# EAGLE design AVRAndDriver (EAGLE 5.04)
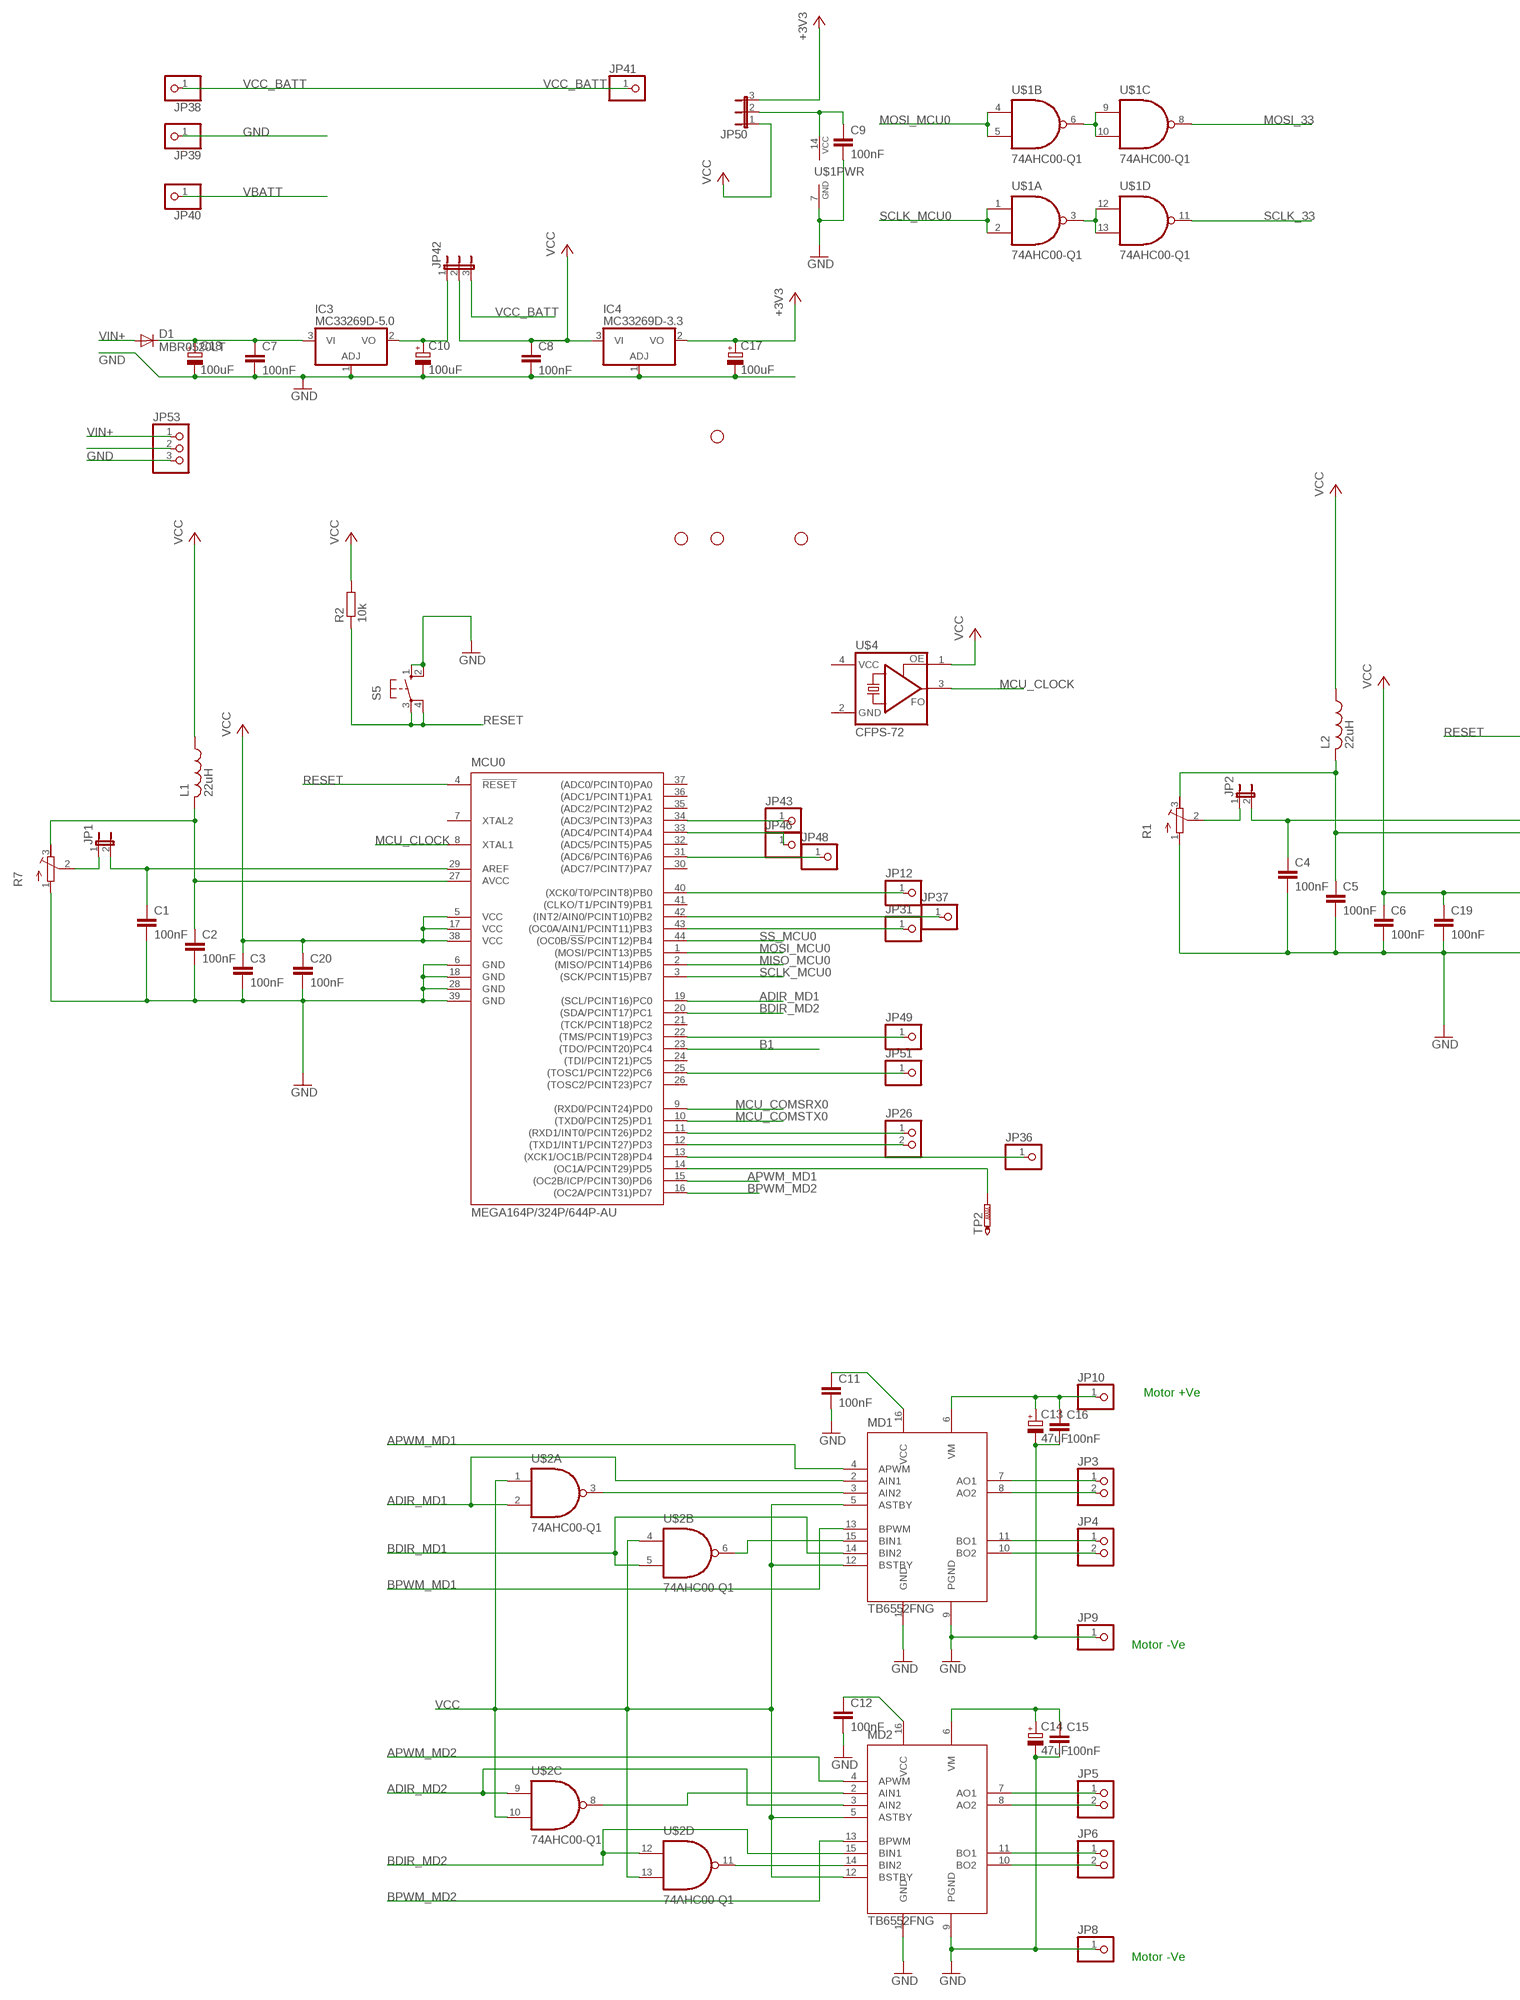
[diagram p0: schematic, sheet 1, part 1 of 2]
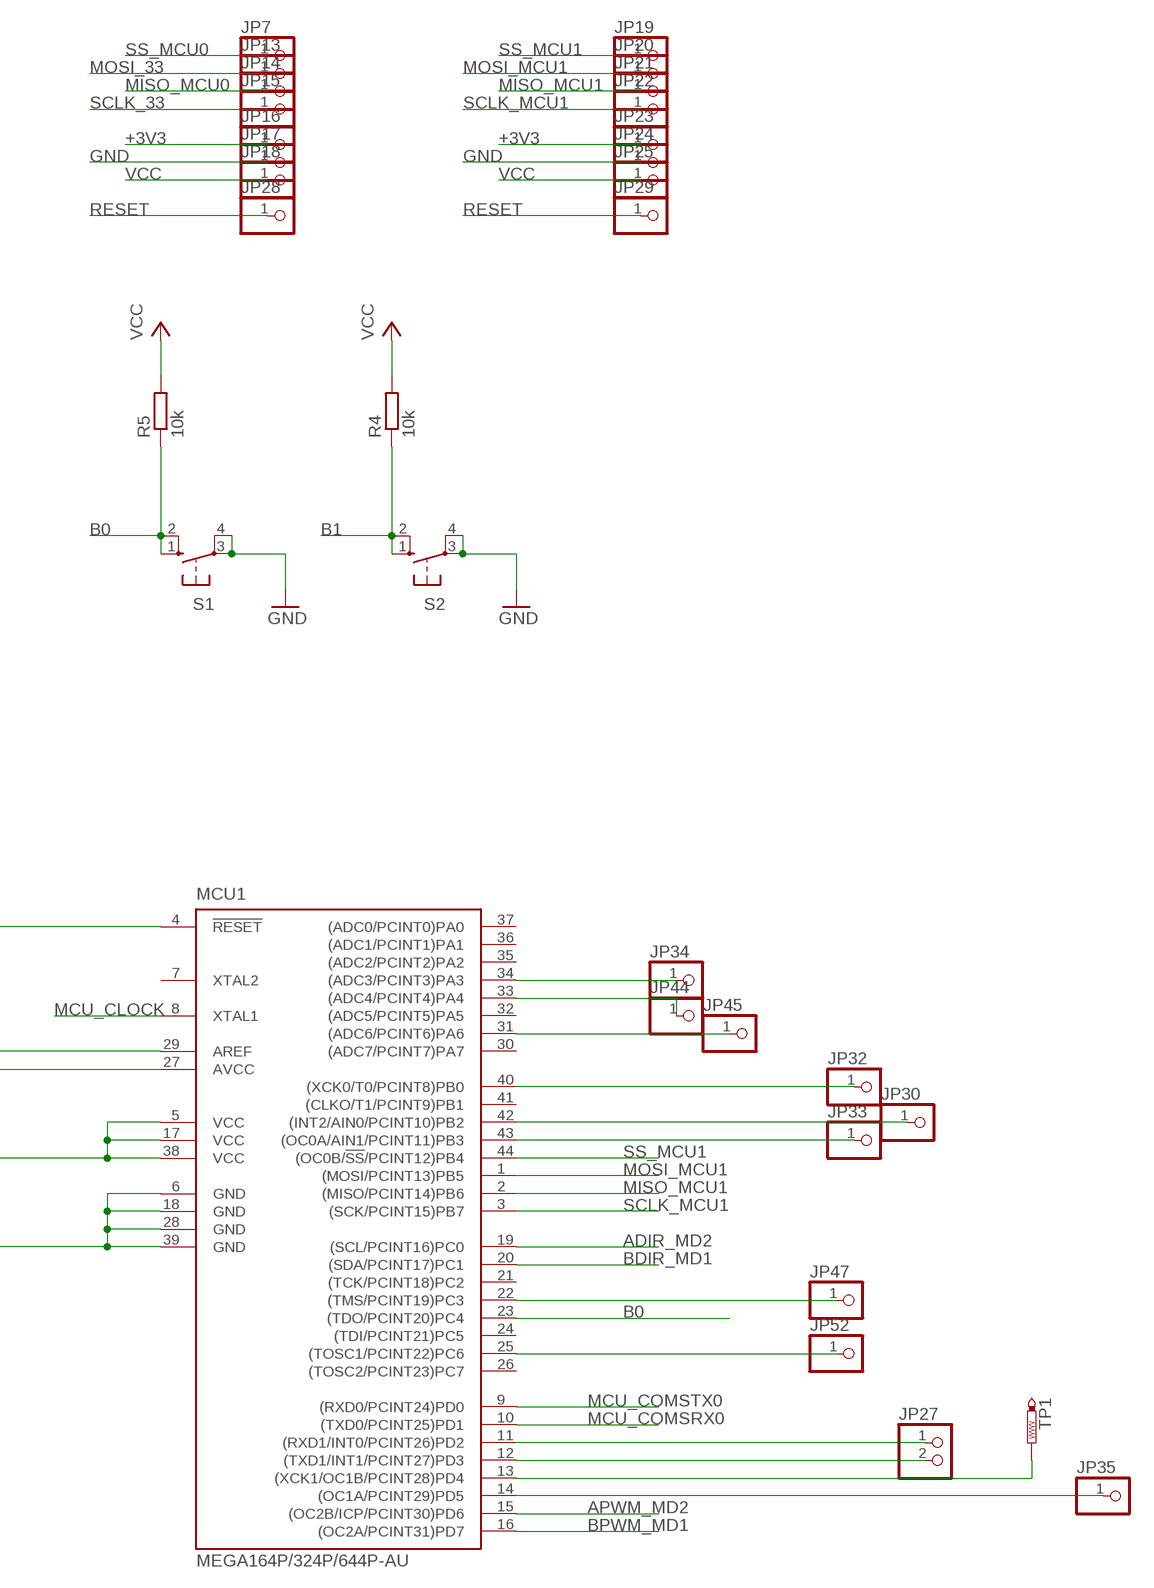
[diagram p1: schematic, sheet 1, part 2 of 2]

## Parts
C1  100nF  C-EUC1206K  [C1206K]
C2  100nF  C-EUC1206K  [C1206K]
C3  100nF  C-EUC1206K  [C1206K]
C4  100nF  C-EUC1206K  [C1206K]
C5  100nF  C-EUC1206K  [C1206K]
C6  100nF  C-EUC1206K  [C1206K]
C7  100nF  C-EUC1206K  [C1206K]
C8  100nF  C-EUC1206K  [C1206K]
C9  100nF  C-EUC1206K  [C1206K]
C10  100uF  CPOL-EUE2-5  [E2-5]
C11  100nF  C-EUC1206K  [C1206K]
C12  100nF  C-EUC1206K  [C1206K]
C13  47uF  CPOL-EUE2-5  [E2-5]
C14  47uF  CPOL-EUE2-5  [E2-5]
C15  100nF  C-EUC1206K  [C1206K]
C16  100nF  C-EUC1206K  [C1206K]
C17  100uF  CPOL-EUE2-5  [E2-5]
C18  100uF  CPOL-EUE2-5  [E2-5]
C19  100nF  C-EUC1206K  [C1206K]
C20  100nF  C-EUC1206K  [C1206K]
D1  MBR0520LT  [SOD123]
IC3  MC33269D-5.0  [DPACK]
IC4  MC33269D-3.3  [DPACK]
JP1  JP1E  [JP1]
JP2  JP1E  [JP1]
JP3  PINHD-1X2  [1X02]
JP4  PINHD-1X2  [1X02]
JP5  PINHD-1X2  [1X02]
JP6  PINHD-1X2  [1X02]
JP7  PINHD-1X1  [1X01]
JP8  PINHD-1X1  [1X01]
JP9  PINHD-1X1  [1X01]
JP10  PINHD-1X1  [1X01]
JP12  PINHD-1X1  [1X01]
JP13  PINHD-1X1  [1X01]
JP14  PINHD-1X1  [1X01]
JP15  PINHD-1X1  [1X01]
JP16  PINHD-1X1  [1X01]
JP17  PINHD-1X1  [1X01]
JP18  PINHD-1X1  [1X01]
JP19  PINHD-1X1  [1X01]
JP20  PINHD-1X1  [1X01]
JP21  PINHD-1X1  [1X01]
JP22  PINHD-1X1  [1X01]
JP23  PINHD-1X1  [1X01]
JP24  PINHD-1X1  [1X01]
JP25  PINHD-1X1  [1X01]
JP26  PINHD-1X2  [1X02]
JP27  PINHD-1X2  [1X02]
JP28  PINHD-1X1  [1X01]
JP29  PINHD-1X1  [1X01]
JP30  PINHD-1X1  [1X01]
JP31  PINHD-1X1  [1X01]
JP32  PINHD-1X1  [1X01]
JP33  PINHD-1X1  [1X01]
JP34  PINHD-1X1  [1X01]
JP35  PINHD-1X1  [1X01]
JP36  PINHD-1X1  [1X01]
JP37  PINHD-1X1  [1X01]
JP38  PINHD-1X1  [1X01]
JP39  PINHD-1X1  [1X01]
JP40  PINHD-1X1  [1X01]
JP41  PINHD-1X1  [1X01]
JP42  JP2E  [JP2]
JP43  PINHD-1X1  [1X01]
JP44  PINHD-1X1  [1X01]
JP45  PINHD-1X1  [1X01]
JP46  PINHD-1X1  [1X01]
JP47  PINHD-1X1  [1X01]
JP48  PINHD-1X1  [1X01]
JP49  PINHD-1X1  [1X01]
JP50  JP2E  [JP2]
JP51  PINHD-1X1  [1X01]
JP52  PINHD-1X1  [1X01]
JP53  PINHD-1X3  [1X03]
L1  22uH  L-US  [ELL6SH]
L2  22uH  L-US  [ELL6SH]
MCU0  MEGA164P/324P/644P-AU  [TQFP44]
MCU1  MEGA164P/324P/644P-AU  [TQFP44]
MD1  TB6552FNG  [SSOP16-P-225-0.65B]
MD2  TB6552FNG  [SSOP16-P-225-0.65B]
R1  R-TRIMM3296W  [RTRIM3296W]
R2  10k  R-EU_R0805  [R0805]
R4  10k  R-EU_R0805  [R0805]
R5  10k  R-EU_R0805  [R0805]
R7  R-TRIMM3296W  [RTRIM3296W]
S1  10-XX  [B3F-10XX]
S2  10-XX  [B3F-10XX]
S5  10-XX  [B3F-10XX]
TP1  PTR1TP10R  [TP10R]
TP2  PTR1TP10R  [TP10R]
U$1  74AHC00-Q1  [TSSOP14-PW]
U$2  74AHC00-Q1  [TSSOP14-PW]
U$3  STAND-OFF  [STAND-OFF]
U$4  CFPS-72  [CFPS]
U$5  STAND-OFF  [STAND-OFF]
U$6  STAND-OFF  [STAND-OFF]
U$7  STAND-OFF  [STAND-OFF]

## Nets
+3V3: C17.+ IC4.2(VO) JP16.1 JP23.1 JP50.3
ADIR_MD1: MCU0.19((SCL/PCINT16)PC0) MD1.2(AIN1) U$2.2(A:B)
ADIR_MD2: MCU1.19((SCL/PCINT16)PC0) MD2.3(AIN2) U$2.9(C:A)
APWM_MD1: MCU0.15((OC2B/ICP/PCINT30)PD6) MD1.4(APWM)
APWM_MD2: MCU1.15((OC2B/ICP/PCINT30)PD6) MD2.4(APWM)
AVCC0: C2.1 L1.2 MCU0.27(AVCC) R7.3(A)
AVCC1: C5.1 L2.2 MCU1.27(AVCC) R1.3(A)
B0: MCU1.23((TDO/PCINT20)PC4) R5.1 S1.1(S) S1.2(S1)
B1: MCU0.23((TDO/PCINT20)PC4) R4.1 S2.1(S) S2.2(S1)
BDIR_MD1: MCU1.20((SDA/PCINT17)PC1) MD1.14(BIN2) U$2.5(B:B)
BDIR_MD2: MCU0.20((SDA/PCINT17)PC1) MD2.15(BIN1) U$2.12(D:A)
BPWM_MD1: MCU1.16((OC2A/PCINT31)PD7) MD1.13(BPWM)
BPWM_MD2: MCU0.16((OC2A/PCINT31)PD7) MD2.13(BPWM)
GND: C1.2 C2.2 C3.2 C4.2 C5.2 C6.2 C7.2 C8.2 C9.2 C10.- C11.2 C12.2 C17.- C18.- C19.2 C20.2 IC3.1(ADJ) IC4.1(ADJ) JP17.1 JP24.1 JP39.1 JP53.2 MCU0.6(GND) MCU0.18(GND) MCU0.28(GND) MCU0.39(GND) MCU1.6(GND) MCU1.18(GND) MCU1.28(GND) MCU1.39(GND) MD1.1(GND) MD2.1(GND) R1.1(E) R7.1(E) S1.3(P) S1.4(P1) S2.3(P) S2.4(P1) S5.1(S) S5.2(S1) U$1.7(PWR:GND)
MCU_CLOCK: MCU0.8(XTAL1) MCU1.8(XTAL1) U$4.3(FO)
MCU_COMSRX0: MCU0.9((RXD0/PCINT24)PD0) MCU1.10((TXD0/PCINT25)PD1)
MCU_COMSTX0: MCU0.10((TXD0/PCINT25)PD1) MCU1.9((RXD0/PCINT24)PD0)
MISO_MCU0: JP14.1 MCU0.2((MISO/PCINT14)PB6)
MISO_MCU1: JP21.1 MCU1.2((MISO/PCINT14)PB6)
MOSI_33: JP13.1 U$1.8(C:OUT)
MOSI_MCU0: MCU0.1((MOSI/PCINT13)PB5) U$1.4(B:A) U$1.5(B:B)
MOSI_MCU1: JP20.1 MCU1.1((MOSI/PCINT13)PB5)
N$1: JP30.1 MCU1.42((INT2/AIN0/PCINT10)PB2)
N$2: JP32.1 MCU1.40((XCK0/T0/PCINT8)PB0)
N$3: JP48.1 MCU0.31((ADC6/PCINT6)PA6)
N$4: C10.+ IC3.2(VO) JP42.1
N$5: JP27.1 MCU1.11((RXD1/INT0/PCINT26)PD2)
N$6: JP36.1 MCU0.13((XCK1/OC1B/PCINT28)PD4)
N$7: JP1.1 R7.2(S)
N$8: C1.1 JP1.2 MCU0.29(AREF)
N$9: JP27.2 MCU1.12((TXD1/INT1/PCINT27)PD3)
N$10: MCU0.14((OC1A/PCINT29)PD5) TP2.TP
N$11: JP31.1 MCU0.43((OC0A/AIN1/PCINT11)PB3)
N$12: C4.1 JP2.2 MCU1.29(AREF)
N$13: MCU1.13((XCK1/OC1B/PCINT28)PD4) TP1.TP
N$14: JP2.1 R1.2(S)
N$15: U$1.3(A:OUT) U$1.12(D:A) U$1.13(D:B)
N$16: U$1.6(B:OUT) U$1.9(C:A) U$1.10(C:B)
N$17: C7.1 C18.+ D1.C IC3.3(VI)
N$18: JP26.2 MCU0.12((TXD1/INT1/PCINT27)PD3)
N$19: JP26.1 MCU0.11((RXD1/INT0/PCINT26)PD2)
N$20: JP35.1 MCU1.14((OC1A/PCINT29)PD5)
N$21: MD2.14(BIN2) U$2.11(D:OUT)
N$22: JP33.1 MCU1.43((OC0A/AIN1/PCINT11)PB3)
N$23: MD1.3(AIN2) U$2.3(A:OUT)
N$24: MD2.2(AIN1) U$2.8(C:OUT)
N$25: JP46.1 MCU0.33((ADC4/PCINT4)PA4)
N$26: MD1.15(BIN1) U$2.6(B:OUT)
N$27: JP43.1 MCU0.34((ADC3/PCINT3)PA3)
N$28: JP37.1 MCU0.42((INT2/AIN0/PCINT10)PB2)
N$29: JP12.1 MCU0.40((XCK0/T0/PCINT8)PB0)
N$30: JP34.1 MCU1.34((ADC3/PCINT3)PA3)
N$31: JP3.1 MD1.7(AO1)
N$32: JP3.2 MD1.8(AO2)
N$33: JP4.1 MD1.11(BO1)
N$34: JP4.2 MD1.10(BO2)
N$35: JP5.1 MD2.7(AO1)
N$36: JP5.2 MD2.8(AO2)
N$37: JP6.1 MD2.11(BO1)
N$38: JP6.2 MD2.10(BO2)
N$39: JP45.1 MCU1.31((ADC6/PCINT6)PA6)
N$40: JP44.1 MCU1.33((ADC4/PCINT4)PA4)
N$41: JP47.1 MCU1.22((TMS/PCINT19)PC3)
N$42: JP49.1 MCU0.22((TMS/PCINT19)PC3)
N$43: C9.1 JP50.2 U$1.14(PWR:VCC)
N$44: JP51.1 MCU0.25((TOSC1/PCINT22)PC6)
N$45: JP52.1 MCU1.25((TOSC1/PCINT22)PC6)
PGND: C13.- C14.- C15.2 C16.2 JP8.1 JP9.1 MD1.9(PGND) MD2.9(PGND) ; supply symbol labelled GND
RESET: JP28.1 JP29.1 MCU0.4(!RESET) MCU1.4(!RESET) R2.1 S5.3(P) S5.4(P1)
SCLK_33: JP15.1 U$1.11(D:OUT)
SCLK_MCU0: MCU0.3((SCK/PCINT15)PB7) U$1.1(A:A) U$1.2(A:B)
SCLK_MCU1: JP22.1 MCU1.3((SCK/PCINT15)PB7)
SS_MCU0: JP7.1 MCU0.44((OC0B/!SS!/PCINT12)PB4)
SS_MCU1: JP19.1 MCU1.44((OC0B/!SS!/PCINT12)PB4)
VBATT: JP40.1 JP53.3
VCC: C3.1 C6.1 C8.1 C11.1 C12.1 C19.1 C20.1 IC4.3(VI) JP18.1 JP25.1 JP42.2 JP50.1 L1.1 L2.1 MCU0.5(VCC) MCU0.17(VCC) MCU0.38(VCC) MCU1.5(VCC) MCU1.17(VCC) MCU1.38(VCC) MD1.5(ASTBY) MD1.12(BSTBY) MD1.16(VCC) MD2.5(ASTBY) MD2.12(BSTBY) MD2.16(VCC) R2.2 R4.2 R5.2 U$2.1(A:A) U$2.4(B:A) U$2.10(C:B) U$2.13(D:B) U$4.1(OE)
VCC_BATT: JP38.1 JP41.1 JP42.3
VIN+: D1.A JP53.1
VM: C13.+ C14.+ C15.1 C16.1 JP10.1 MD1.6(VM) MD2.6(VM)
Unconnected: MCU0.7(XTAL2) MCU0.21((TCK/PCINT18)PC2) MCU0.24((TDI/PCINT21)PC5) MCU0.26((TOSC2/PCINT23)PC7) MCU0.30((ADC7/PCINT7)PA7) MCU0.32((ADC5/PCINT5)PA5) MCU0.35((ADC2/PCINT2)PA2) MCU0.36((ADC1/PCINT1)PA1) MCU0.37((ADC0/PCINT0)PA0) MCU0.41((CLKO/T1/PCINT9)PB1) MCU1.7(XTAL2) MCU1.21((TCK/PCINT18)PC2) MCU1.24((TDI/PCINT21)PC5) MCU1.26((TOSC2/PCINT23)PC7) MCU1.30((ADC7/PCINT7)PA7) MCU1.32((ADC5/PCINT5)PA5) MCU1.35((ADC2/PCINT2)PA2) MCU1.36((ADC1/PCINT1)PA1) MCU1.37((ADC0/PCINT0)PA0) MCU1.41((CLKO/T1/PCINT9)PB1)

## Notes on the sheet
- Motor +Ve
- Motor -Ve
- Motor -Ve

## Power pins joined to a net without a drawn wire
GND: U$2.7(PWR:GND) U$4.2(GND)
VCC: U$2.14(PWR:VCC) U$4.4(VCC)

## Library data of the parts
C1-C9 C11 C12 C15 C16 C19 C20 = rcl:C-EU: CAPACITOR, European symbol
C10 C13 C14 C17 C18 = rcl:CPOL-EU: POLARIZED CAPACITOR, European symbol
D1 = diode:MBR0520LT: SCHOTTKY BARRIER RECTIFIER Source: http://onsemi.com .. MBR0520LT1-D.pdf
IC3 IC4 = linear:MC33269?*: Adjustable Output Low Dropout Voltage Regulator 800 mA Source: http://www.onsemi.com/pub/Collateral/MC33269-D.PDF
JP1 JP2 = jumper:JP1E: JUMPER
JP3-JP6 JP26 JP27 = pinhead:PINHD-1X2: PIN HEADER
JP7-JP10 JP12-JP25 JP28-JP41 JP43-JP49 JP51 JP52 = pinhead:PINHD-1X1: PIN HEADER
JP42 JP50 = jumper:JP2E: JUMPER
JP53 = pinhead:PINHD-1X3: PIN HEADER
L1 L2 = rcl:L-US: INDUCTOR, American symbol
MCU0 MCU1 = avr-5:MEGA164P/324P/644P-AU
MD1 MD2 = toshiba-MotorDrivers:TB6552FNG
R1 R7 = rcl:R-TRIMM: Trimm resistor
R2 R4 R5 = rcl:R-EU_: RESISTOR, European symbol
S1 S2 S5 = switch-omron:10-XX: OMRON SWITCH
TP1 TP2 = testpad:PTR1: TEST PIN
U$1 U$2 = 74ah:74AHC00-Q1
U$3 U$5-U$7 = SparkFun:STAND-OFF: Stand Off This is the mechanical footprint for a #4 phillips button head screw. Use the keepout ring to avoid running the screw head into surrounding components. SKU : PRT-00447
U$4 = crystal:CFPS-72

## Board
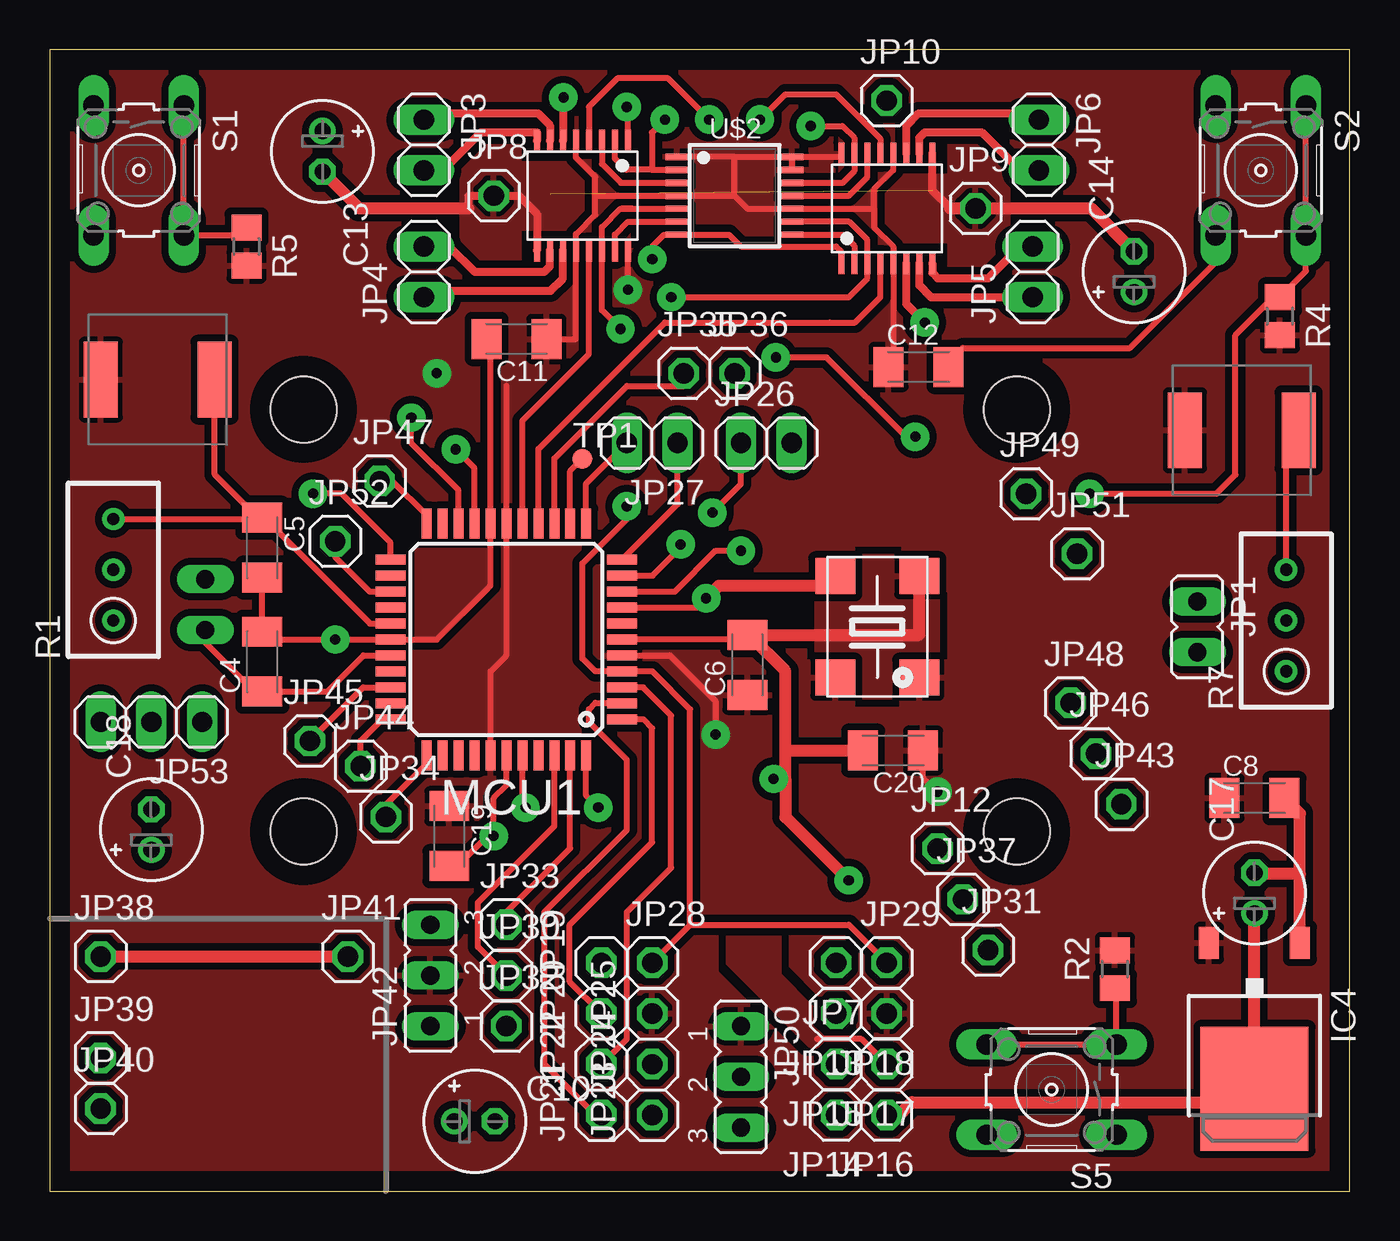
[diagram p2: board, top side]
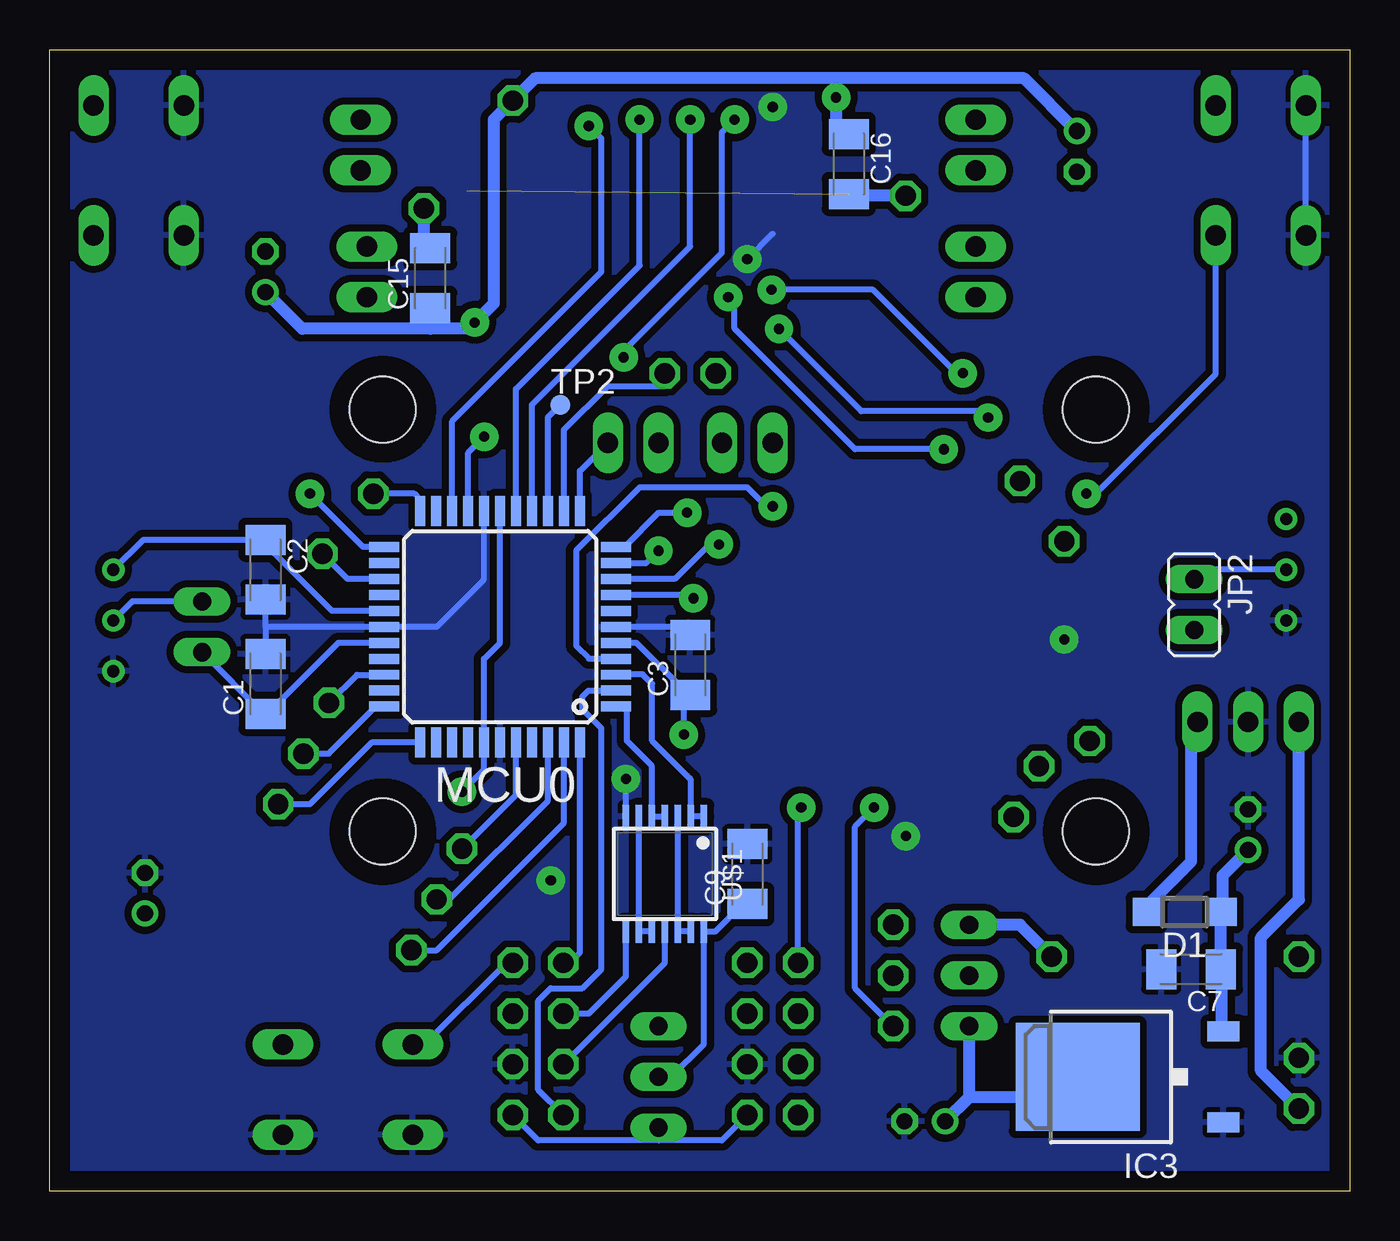
[diagram p3: board, bottom side, seen from below]

Size 65.09 x 57.15 mm. Coordinates in mm from the lower left corner, seen from the top.
Outline: 0,0 65.09,0 65.09,57.15 0,57.15 0,0
Copper layers (1*16): Top 0.035mm / dielectric 1.5mm / Bottom 0.035mm
Design rules "default *": minimum track width 12mil, minimum drill 24mil, track to track 12mil, track to pad 12mil, pad to pad 12mil, via to via 12mil, smd to smd 12mil, copper to edge 40mil, drill to drill 6mil, minimum pad ring 10mil, minimum via ring 8mil, stop-mask expansion 4mil, vias tented up to drill 0mil, thermal gap 10mil

### Footprints (pad centres in the part's own frame; a part is rotated, then mirrored left to right if it is on the bottom)
C1206K = smd 1.5 x 2: 1 -1.5,0; 2 1.5,0
E2-5 = drill 0.813 pad 1.27 round: + -1.016,0 | drill 0.813 pad 1.27 octagon: - 1.016,0
SOD123 = smd 1.4 x 1.4: A 1.9,0; C -1.9,0
DPACK = smd 1 x 1.6: 1 -2.28,-4.8; 3 2.28,-4.8 | smd 5.4 x 6.2: 2 0,2.5
JP1 = drill 0.914 long: 1 0,-1.27; 2 0,1.27
1X02 = drill 1.016 long: 1 -1.27,0; 2 1.27,0
1X01 = drill 1.016 octagon: 1 0,0
JP2 = drill 0.914 long: 1 -2.54,0; 2 0,0; 3 2.54,0
1X03 = drill 1.016 long: 1 -2.54,0; 2 0,0; 3 2.54,0
ELL6SH = smd 1.7 x 3.8: 1 -2.85,0; 2 2.85,0
TQFP44 = smd 1.5 x 0.5: 1 -5.8,4; 2 -5.8,3.2; 3 -5.8,2.4; 4 -5.8,1.6; 5 -5.8,0.8; 6 -5.8,0; 7 -5.8,-0.8; 8 -5.8,-1.6; 9 -5.8,-2.4; 10 -5.8,-3.2; 11 -5.8,-4; 23 5.8,-4; 24 5.8,-3.2; 25 5.8,-2.4; 26 5.8,-1.6; 27 5.8,-0.8; 28 5.8,0; 29 5.8,0.8; 30 5.8,1.6; 31 5.8,2.4; 32 5.8,3.2; 33 5.8,4 | smd 0.5 x 1.5: 12 -4,-5.8; 13 -3.2,-5.8; 14 -2.4,-5.8; 15 -1.6,-5.8; 16 -0.8,-5.8; 17 0,-5.8; 18 0.8,-5.8; 19 1.6,-5.8; 20 2.4,-5.8; 21 3.2,-5.8; 22 4,-5.8; 34 4,5.8; 35 3.2,5.8; 36 2.4,5.8; 37 1.6,5.8; 38 0.8,5.8; 39 0,5.8; 40 -0.8,5.8; 41 -1.6,5.8; 42 -2.4,5.8; 43 -3.2,5.8; 44 -4,5.8
SSOP16-P-225-0.65B = smd 1.1 x 0.3: 1 -2.75,2.275; 2 -2.75,1.625; 3 -2.75,0.975; 4 -2.75,0.325; 5 -2.75,-0.325; 6 -2.75,-0.975; 7 -2.75,-1.625; 8 -2.75,-2.275; 9 2.75,-2.275; 10 2.75,-1.625; 11 2.75,-0.975; 12 2.75,-0.325; 13 2.75,0.325; 14 2.75,0.975; 15 2.75,1.625; 16 2.75,2.275
RTRIM3296W = drill 0.61 round: 1 0,-2.54; 2 0,0; 3 0,2.54
R0805 = smd 1.3 x 1.5: 1 -0.95,0; 2 0.95,0
B3F-10XX = drill 1.016 long: 1 -3.251,2.261; 2 3.251,2.261; 3 -3.251,-2.261; 4 3.251,-2.261
TP10R = smd 1 x 1: TP 0,0
TSSOP14-PW = smd 0.32 x 1.15: 1 -1.95,-2.875; 2 -1.3,-2.875; 3 -0.65,-2.875; 4 0,-2.875; 5 0.65,-2.875; 6 1.3,-2.875; 7 1.95,-2.875; 8 1.95,2.875; 9 1.3,2.875; 10 0.65,2.875; 11 0,2.875; 12 -0.65,2.875; 13 -1.3,2.875; 14 -1.95,2.875
STAND-OFF = hole 3.302: 0,0
CFPS = smd 1.8 x 2: 1 -2.54,-2.1; 2 2.54,-2.1; 3 2.54,2.1; 4 -2.54,2.1

### Placement (x,y rotation side)
C1  54.29,25.4 90 bottom
C2  54.29,31.11 270 bottom
C3  33.02,26.35 90 bottom
C4  10.64,26.51 90 top
C5  10.64,32.23 270 top
C6  34.92,26.35 90 top
C7  7.94,11.11 180 bottom
C8  60.33,19.68 0 top
C9  30.16,15.88 90 bottom
C10  21.27,3.49 0 top
C11  23.37,42.67 180 top
C12  43.5,41.27 0 top
C13  13.65,52.07 270 top
C14  54.29,46.04 90 top
C15  46.04,45.72 90 bottom
C16  25.08,51.44 270 bottom
C17  60.33,14.92 90 top
C18  5.08,18.1 90 top
C19  20,17.78 270 top
C20  42.23,22.07 180 top
D1  8.26,13.97 180 bottom
IC3  11.11,5.71 90 bottom
IC4  60.33,7.62 180 top
JP1  57.47,28.26 180 top
JP2  7.78,29.37 180 bottom
JP3  18.73,52.39 270 top
JP4  18.73,46.04 90 top
JP5  49.21,46.04 90 top
JP6  49.53,52.39 270 top
JP7  39.37,11.43 180 top
JP8  22.23,49.85 0 top
JP9  46.35,49.21 0 top
JP10  41.91,54.61 0 top
JP12  44.45,17.14 0 top
JP13  39.37,8.89 180 top
JP14  39.37,3.81 180 top
JP15  39.37,6.35 180 top
JP16  41.91,3.81 180 top
JP17  41.91,6.35 180 top
JP18  41.91,8.89 180 top
JP19  27.62,11.43 90 top
JP20  27.62,8.89 90 top
JP21  27.62,3.81 90 top
JP22  27.62,6.35 90 top
JP23  30.16,3.81 90 top
JP24  30.16,6.35 90 top
JP25  30.16,8.89 90 top
JP26  35.88,37.47 0 top
JP27  30.16,37.47 180 top
JP28  30.16,11.43 0 top
JP29  41.91,11.43 0 top
JP30  22.86,10.79 0 top
JP31  46.99,12.06 0 top
JP32  22.86,8.26 0 top
JP33  22.86,13.34 0 top
JP34  16.83,18.73 0 top
JP35  31.75,40.96 0 top
JP36  34.29,40.96 0 top
JP37  45.72,14.61 0 top
JP38  2.54,11.75 0 top
JP39  2.54,6.67 0 top
JP40  2.54,4.13 0 top
JP41  14.92,11.75 0 top
JP42  19.05,10.79 90 top
JP43  53.66,19.37 0 top
JP44  15.56,21.27 0 top
JP45  13.02,22.54 0 top
JP46  52.39,21.91 0 top
JP47  16.51,35.56 0 top
JP48  51.12,24.45 0 top
JP49  48.9,34.92 0 top
JP50  34.61,5.71 270 top
JP51  51.44,31.91 0 top
JP52  14.29,32.54 0 top
JP53  5.08,23.5 180 top
L1  59.69,38.1 0 top
L2  5.4,40.64 0 top
MCU0  42.55,28.26 180 bottom
MCU1  22.86,27.62 180 top
MD1  26.67,49.85 270 top
MD2  41.91,49.21 90 top
R1  3.17,31.11 0 top
R2  53.34,11.11 90 top
R4  61.59,43.81 270 top
R5  9.84,47.31 270 top
R7  61.91,28.57 0 top
S1  4.45,51.12 270 top
S2  60.64,51.12 270 top
S5  50.16,5.08 180 top
TP1  26.67,36.67 0 top
TP2  39.53,39.37 0 bottom
U$1  34.29,15.88 180 bottom
U$2  34.29,49.85 270 top
U$3  48.42,39.14 0 top
U$4  41.43,28.26 90 top
U$5  48.42,18.01 0 top
U$6  12.7,18.01 0 top
U$7  12.7,39.14 0 top

### Tracks (layer width: path | path; a pad name or v marks a point on that pad's centre or on a via)
+3V3
  Top 0.61: C17.+ IC4.2 60.33,4.45 43.18,4.45 42.39,3.65 41.91,3.65 JP16.1
  Bottom 0.305: JP16.1 40.64,2.54 34.61,2.54 | JP23.1 31.43,2.54 34.61,2.54 | 34.61,2.54 JP50.3
ADIR_MD1  (via drill 0.51 pad 1.42)
  Top 0.305: MD1.2 28.3,51.72 28.86,51.15 30.15,51.15 | 30.15,51.15 U$2.2 | 30.15,51.15 30.15,53.01 v30.8,53.66 | v43.34,37.78 42.86,37.78 38.89,41.75 v36.35,41.75
  Bottom 0.305: v30.8,53.66 31.43,53.02 31.43,46.99 36.35,42.07 v36.35,41.75 | MCU0.19 44.15,36.98 v43.34,37.78
ADIR_MD2  (via drill 0.51 pad 1.42)
  Top 0.305: U$2.9 40.03,48.55 40.94,47.65 MD2.3 40.94,45.7 40.01,44.77 v31.11,44.77 | MCU1.19 21.26,36.21 v20.32,37.15
  Bottom 0.305: v31.11,44.77 30.8,44.45 30.8,43.18 24.77,37.15 v20.32,37.15
APWM_MD1  (via drill 0.51 pad 1.42)
  Top 0.305: MD1.4 27,54.3 28.42,55.72 30.96,55.72 v33.02,53.66
  Bottom 0.305: v33.02,53.66 33.02,47.31 40.95,39.38 MCU0.15
APWM_MD2
  Top 0.305: MCU1.15 24.46,37.16 30.8,43.5 39.05,43.5 40.32,43.5 41.59,44.76 MD2.4
AVCC0
  Top 0.305: L1.2 61.91,37.47 R7.3
  Bottom 0.305: C2.1 54.52,32.62 | R7.3 60.41,32.62 C2.1 | MCU0.27 50.97,29.06 54.29,32.38 C2.1
AVCC1
  Top 0.305: L2.2 8.26,39.36 8.26,35.88 10.41,33.73 C5.1 | MCU1.27 16.03,28.42 10.72,33.73 C5.1 | C5.1 10.64,33.66 R1.3
B0  (via drill 0.51 pad 1.42)
  Top 0.305: S1.1 S1.2 9.84,47.87 R5.1 | MCU1.23 17.06,32.47 14.61,34.92 v13.18,34.92
  Bottom 0.305: S1.2 6.71,40.92 12.7,34.92 v13.18,34.92
B1  (via drill 0.51 pad 1.42)
  Top 0.305: S2.1 S2.2 62.9,46.07 R4.1 61.28,44.77 59.37,42.86 59.37,35.88 58.42,34.92 v52.07,34.92
  Bottom 0.305: MCU0.23 49.4,32.26 v52.07,34.92
BDIR_MD1  (via drill 0.51 pad 1.42)
  Top 0.305: 29.21,49.2 28.59,49.2 | 29.21,49.2 U$2.5 | 29.21,49.2 28.56,49.2 27.64,48.28 MD1.14 27.64,44.11 v28.57,43.18 | MCU1.20 20.46,35.1 18.1,37.47 v18.1,38.73
  Bottom 0.305: v28.57,43.18 24.45,39.05 18.41,39.05 v18.1,38.73
BDIR_MD2  (via drill 0.51 pad 1.42)
  Top 0.305: U$2.12 37.18,50.48 39.69,50.48 40.28,51.08 MD2.15 40.28,52.74 39.69,53.34 v38.1,53.34
  Bottom 0.305: v38.1,53.34 37.47,52.7 37.47,46.04 44.95,38.56 MCU0.20
BPWM_MD1
  Top 0.305: MD1.13 27,41.92 23.66,38.58 MCU1.16
BPWM_MD2  (via drill 0.51 pad 1.42)
  Top 0.305: MD2.13 41.59,52.71 39.37,54.93 36.83,54.93 v35.56,53.66
  Bottom 0.305: v35.56,53.66 35.56,46.35 41.74,40.17 MCU0.16
GND  (via drill 0.51 pad 1.42)
  Top 0.305: MD2.1 39.63,47.04 39.37,47.31 34.61,47.31 34.02,47.9 U$2.7 30.75,47.9 30.16,47.31 v30.16,46.67 | C12.2 45,41.51 45.72,42.23 54.09,42.23 58.38,46.52 S2.4 | MCU1.6 34.92,27.62 C6.2 | MCU1.39 22.86,20.32 22.23,19.68 v22.23,17.78 21.91,17.78 20.41,16.28 C19.2 | C5.2 | C5.2 C4.2 10.64,27.62 v14.29,27.62 MCU1.28 19.37,27.62 22.06,30.32 MCU1.18 22.06,42.67 C11.2 | MD1.1 28.95,54.24 v28.89,54.29 | JP17.1 40.64,7.62 38.42,7.62
  Top 0.61: IC4.1 62.6,15.88 | 62.6,15.88 62.6,18.91 C8.2 | 35.01,27.85 C6.2 34.92,28.29 | 35.01,27.85 36.83,26.04 36.83,22.07 | v36.24,20.64 36.83,20.64 | 35.01,27.85 43.53,27.85 U$4.2 | 36.83,22.07 C20.2 | 36.83,20.64 36.83,22.07 | C17.- 60.33,15.88 62.6,15.88 | 36.83,20.64 36.83,18.73 v40.01,15.56
  Bottom 0.305: S1.4 S1.3 | MCU0.6 33.02,28.26 C3.2 | v30.16,46.67 28.89,47.94 | U$1.7 v36.24,20.64 | MCU0.18 43.34,30.63 45.72,28.26 MCU0.28 54.29,28.26 | 54.29,28.26 C1.2 | 54.29,28.26 C2.2
  pour Bottom (isolate 0.356, rank 2): 0,0 0,57.15 65.09,57.15 65.09,0
  pour Top (isolate 0.356, rank 2): 40.48,31.75 38.42,29.69 38.42,26.83 40.48,24.77 42.39,24.77 44.45,26.99 44.45,29.53 42.39,31.75
  pour Top (isolate 0.356, rank 3): 18.41,32.07 21.91,32.07 21.91,30.16 19.37,27.62 18.41,27.62
  pour Top (isolate 0.356, rank 2): 33.97,12.7 33.97,11.43 38.1,7.3 38.42,7.3 38.73,7.62 38.42,7.94 38.1,8.26 38.1,9.21 36.51,10.79 36.51,12.7
MCU_CLOCK  (via drill 0.51 pad 1.42)
  Top 0.305: MCU1.8 32.4,29.22 v32.86,29.69 | U$4.3 39.33,30.16
  Top 0.61: v32.86,29.69 33.5,30.32 39.33,30.32 U$4.3
  Bottom 0.305: MCU0.8 33.03,29.86 v32.86,29.69
MCU_COMSRX0  (via drill 0.51 pad 1.42)
  Top 0.305: MCU1.10 30.19,30.82 31.58,32.22 v31.58,32.38
  Bottom 0.305: MCU0.9 33.8,30.66 32.07,32.38 v31.58,32.38
MCU_COMSTX0  (via drill 0.51 pad 1.42)
  Top 0.305: MCU1.9 31.29,30.02 33.34,32.07 v34.61,32.07
  Bottom 0.305: MCU0.10 36.72,31.43 35.24,31.43 v34.61,32.07
MISO_MCU0
  Bottom 0.305: MCU0.2 38.12,25.06 38.42,24.77 38.42,24.13 37.47,23.18 37.47,11.11 38.42,10.16 40.01,10.16 40.64,9.53 40.64,5.08 JP14.1
MISO_MCU1
  Top 0.305: MCU1.2 28.64,24.45 27.3,24.45 26.99,24.13 26.99,23.5 28.89,21.59 28.89,18.1 24.77,13.97 24.77,6.35 27.3,3.81 JP21.1
MOSI_33
  Bottom 0.305: U$1.8 36.24,10.75 38.1,8.89 JP13.1
MOSI_MCU0
  Bottom 0.305: U$1.4 U$1.5 34.94,21.29 36.2,22.54 36.2,24.26 MCU0.1
MOSI_MCU1
  Top 0.305: MCU1.1 29.72,23.62 30.16,23.18 30.16,17.46 26.04,13.34 26.04,10.48 JP20.1
N$1
  Top 0.305: MCU1.42 25.26,18.27 21.43,14.45 21.43,12.22 JP30.1
N$2  (via drill 0.51 pad 1.42)
  Top 0.305: MCU1.40 23.66,19.36 v23.81,19.21
  Bottom 0.305: v23.81,19.21 24.77,18.26 24.77,10.16 JP32.1
N$3
  Bottom 0.305: MCU0.31 49.71,25.86 JP48.1
N$4
  Bottom 0.61: 19.05,4.7 C10.+ | 19.05,4.7 JP42.1 | 19.05,4.7 13.61,4.7 IC3.2
N$5
  Top 0.305: MCU1.11 31.43,34.4 JP27.1
N$6
  Bottom 0.305: MCU0.13 39.34,38.12 37.15,40.32 34.29,40.32 JP36.1
N$7
  Bottom 0.305: JP1.1 60.96,29.53 R7.2
N$8
  Bottom 0.305: MCU0.29 50.65,27.46 54.2,23.9 C1.1 54.38,23.9 JP1.2
N$9
  Top 0.305: MCU1.12 26.86,35.43 JP27.2
N$10
  Bottom 0.305: MCU0.14 40.15,38.75 TP2.TP
N$11
  Bottom 0.305: MCU0.43 39.34,18.44 45.72,12.06 JP31.1
N$12
  Top 0.305: MCU1.29 15.71,26.82 13.9,25.01 C4.1 | C4.1 10.64,25.24 10,25.24 7.78,27.46 JP2.2 | C4.1 10.55,25.01
N$13
  Top 0.305: MCU1.13 26.06,36.06 TP1.TP
N$14
  Bottom 0.305: R1.2 7.3,31.11 JP2.1
N$15
  Bottom 0.305: U$1.13 U$1.12 U$1.3
N$16
  Bottom 0.305: U$1.10 U$1.9 U$1.6
N$17
  Bottom 0.305: IC3.3 6.41,8
  Bottom 0.61: 6.41,8 6.41,11.11 C7.1 6.44,13.97 D1.C 6.36,15.81 C18.+
N$18
  Bottom 0.305: JP26.2 38.55,36.07 MCU0.12
N$19  (via drill 0.51 pad 1.42)
  Top 0.305: JP26.1 34.61,35.4 v33.18,33.97
  Bottom 0.305: v33.18,33.97 34.61,33.97 36.32,32.26 MCU0.11
N$20
  Top 0.305: MCU1.14 25.26,36.69 28.89,40.32 31.75,40.32 JP35.1
N$21
  Top 0.305: U$2.11 40.01,49.85 40.94,50.78 MD2.14
N$22
  Top 0.305: 26.04,21.8 MCU1.43 26.06,17.17 22.86,13.97 JP33.1
N$23
  Top 0.305: 31.4,50.48 U$2.3 28.59,50.5 27.64,51.44 MD1.3
N$24
  Top 0.305: MD2.2 40.28,47.34 39.73,47.9 U$2.8
N$25
  Bottom 0.305: MCU0.33 48.77,24.26 51.12,21.91 JP46.1
N$26
  Top 0.305: MD1.15 28.3,47.91 28.94,48.55 U$2.6
N$27
  Bottom 0.305: MCU0.34 48.98,22.46 52.07,19.37 JP43.1
N$28
  Bottom 0.305: MCU0.42 40.15,19.55 45.09,14.61 JP37.1
N$29
  Bottom 0.305: MCU0.40 41.74,19.85 JP12.1
N$30
  Top 0.305: MCU1.34 18.86,21.4 16.83,19.37 JP34.1
N$31
  Top 0.406: MD1.7 25.05,53.38 24.45,53.98 18.73,53.98 JP3.1
N$32
  Top 0.406: MD1.8 24.39,53.02 21.59,53.02 19.68,51.12 JP3.2
N$33
  Top 0.406: MD1.11 25.7,45.7 25.08,45.09 18.73,45.09 JP4.1
N$34
  Top 0.406: MD1.10 25.05,46.32 24.77,46.04 21.27,46.04 20,47.31 JP4.2
N$35
  Top 0.406: MD2.7 43.53,45.37 44.13,44.77 JP5.1
N$36
  Top 0.406: MD2.8 44.19,45.98 44.45,45.72 46.99,45.72 48.58,47.31 JP5.2
N$37
  Top 0.406: MD2.11 42.88,53.36 43.5,53.98 49.21,53.98 JP6.1
N$38
  Top 0.406: MD2.10 43.53,52.74 43.81,53.02 46.67,53.02 48.58,51.12 JP6.2
N$39
  Top 0.305: MCU1.31 15.7,25.22 JP45.1
N$40
  Top 0.305: MCU1.33 16.64,23.62 15.56,22.54 JP44.1
N$41
  Top 0.305: MCU1.22 18.86,33.84 17.14,35.56 JP47.1
N$42
  Bottom 0.305: JP49.1 46.83,34.92 46.55,34.64 MCU0.22
N$43
  Bottom 0.305: C9.1 30.39,14.38 31.77,13 U$1.14 32.34,7.35 33.97,5.71 JP50.2
N$44
  Bottom 0.305: MCU0.25 50.18,30.66 JP51.1
N$45
  Top 0.305: MCU1.25 16.02,30.02 14.29,31.75 JP52.1
PGND  (1 unrouted)
  Top 0.406: 20.95,49.21 20.95,49.85 JP8.1 23.5,49.85 24.39,48.95 MD1.9 | 45.09,49.21 44.19,50.11 MD2.9
  Top 0.61: 20.95,49.21 15.49,49.21 C13.- | 45.09,49.21 52.13,49.21 C14.-
  Bottom 0.61: C16.2 25.08,49.85 JP8.1 | C15.2 46.35,47.22 JP9.1
  pour Top (isolate 0.356): 45.09,46.04 45.09,52.39 46.35,52.39 47.94,50.8 47.94,46.04
  pour Top (isolate 0.356): 41.91,50.16 41.91,48.26 42.55,47.62 45.4,47.62 45.4,50.8 42.55,50.8
  pour Top (isolate 0.356): 23.5,52.39 21.91,52.39 20.64,51.12 20.64,46.35 23.5,46.35
  pour Top (isolate 0.356): 26.67,48.9 26.67,50.8 26.04,51.44 23.18,51.44 23.18,48.26 26.04,48.26
RESET  (via drill 0.51 pad 1.42)
  Top 0.305: v28.89,34.29 28.89,33.66 26.67,31.43 26.67,26.67 27.32,26.02 MCU1.4 30.18,26.02 32.07,24.13 32.07,13.34 | S5.4 S5.3 53.42,10.16 R2.1 | JP28.1 32.07,13.34 | JP29.1 40.01,13.34 32.07,13.34
  Bottom 0.305: MCU0.4 38.1,26.67 38.73,27.3 38.73,32.07 35.56,35.24 30.16,35.24 29.21,34.29 v28.89,34.29 | JP29.1 42.23,11.43 46.32,7.34 S5.4
SCLK_33
  Bottom 0.305: U$1.11 34.29,11.43 JP15.1
SCLK_MCU0
  Bottom 0.305: U$1.1 U$1.2 32.99,20.61 33.18,20.8 | MCU0.3 36.73,25.88 35.4,25.88 34.92,25.4 34.92,22.54 33.18,20.8 | 33.18,20.8 33.02,20.64
SCLK_MCU1
  Top 0.305: JP22.1 28.89,7.62 28.89,13.97 31.11,16.19 31.11,23.81 29.7,25.22 MCU1.3
SS_MCU0
  Bottom 0.305: MCU0.44 38.55,11.94 39.05,11.43 JP7.1
SS_MCU1  (via drill 0.51 pad 1.42)
  Top 0.305: MCU1.44 26.86,19.81 v27.46,19.21
  Bottom 0.305: JP19.1 27.62,19.21 v27.46,19.21
VBATT
  Bottom 0.61: JP40.1 4.45,6.03 4.45,12.7 2.54,14.61 JP53.3
VCC  (via drill 0.51 pad 1.42)
  Top 0.305: 27.3,49.85 27.3,50.8 26.34,51.76 MD1.5 | 27.3,49.85 27.3,48.9 26.34,47.94 MD1.12 26.34,42.67 C11.1 | U$2.14 37.19,51.8 | 27.3,49.85 U$2.4 34.29,49.85 | 41.27,49.2 U$2.10 34.94,49.2 34.29,49.85 | 41.27,49.2 41.27,48.26 42.23,47.3 MD2.5 42.23,41.27 C12.1 | 41.27,49.2 41.27,50.16 42.23,51.12 MD2.12 | 34.29,51.8 U$2.14 | U$2.14 U$2.13 | 34.29,49.85 34.29,51.8 | 34.29,51.8 U$2.1 | MD2.16 39.63,51.8 U$2.14 | v28.95,45.14 MD1.16 | MCU1.38 22.06,26.02 22.86,26.82 MCU1.17 22.86,40.32 | MCU1.5 31.05,26.82 C3.1 33.34,24.54 v33.34,22.86 | 24.93,42.39 25,42.39 | C20.1 43.73,20.73 v44.45,20 | C19.1 20.55,19.28
  Bottom 0.305: MCU0.17 42.55,27.46 43.34,26.66 MCU0.38 43.34,21.11 v44.45,20 | MCU0.5 35.71,27.46 33.34,25.08 33.25,25.08 C3.1 33.34,24.85 v33.34,22.86 | v28.95,45.14 23.86,45.14 19.68,40.96 v19.37,40.96
  pour Top (isolate 0.356, rank 3): 0,0 0,57.15 65.09,57.15 65.09,0
VCC_BATT
  Top 0.61: JP38.1 JP41.1
  Bottom 0.61: JP41.1 16.51,13.34 JP42.3
VIN+
  Bottom 0.61: D1.A 10.16,14.29 7.94,16.51 7.94,23.5 JP53.1
VM  (via drill 0.51 pad 1.42)
  Top 0.406: MD2.6 42.88,44.43 v43.81,43.5 | MD1.6 25.7,54.77 v25.72,54.77
  Bottom 0.61: 46.04,43.18 44.13,43.18 v43.81,43.5 42.86,44.45 42.86,53.66 JP10.1 40.8,55.72 25.72,55.72 | C16.1 25.72,52.94 v25.72,54.77 25.72,55.72 | 46.04,43.18 C15.1 | 25.72,55.72 16.29,55.72 C13.+ | 46.04,43.18 52.45,43.18 C14.+